# Altium project PCB.PrjPcb
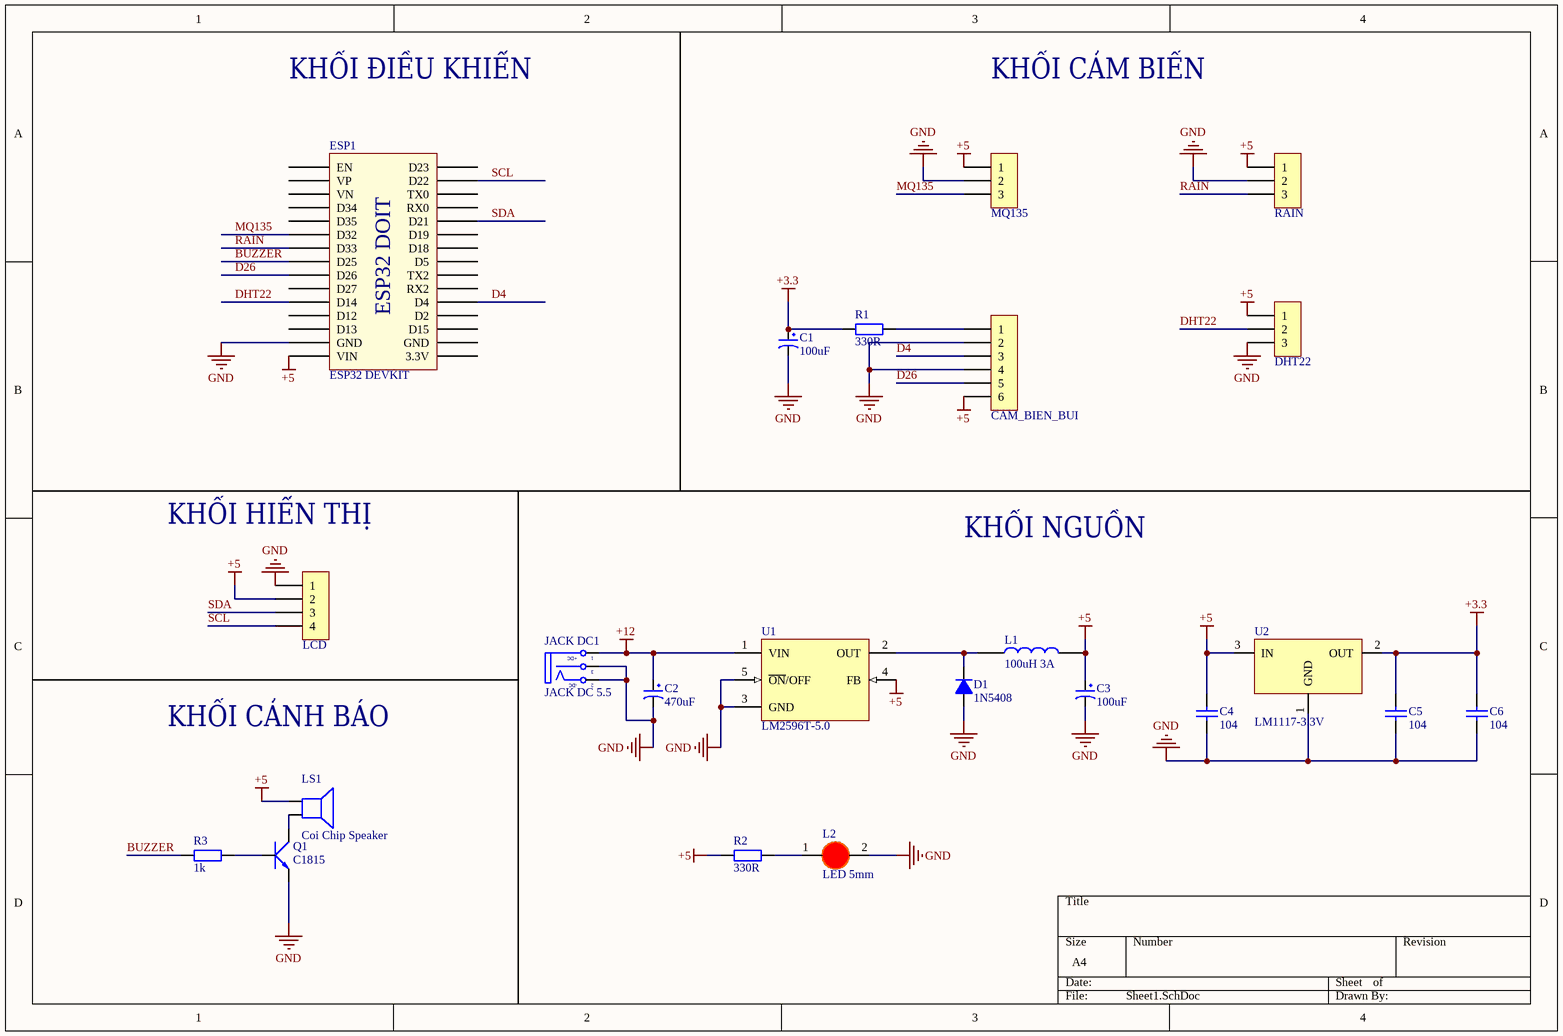
[diagram p0: Sheet1.SchDoc]
1 sheet, 23 parts. Net scope: global (net labels, ports and power ports of the same name join across sheets).
Board file: PCB1.PcbDoc

## Sheet Sheet1.SchDoc
size A4; SheetNumber: 1; SheetTotal: 1

### Parts
C1  100uF  [tu hoa 8mm]
C2  470uF  [tu hoa 8mm]
C3  100uF  [tu hoa 8mm]
C4  104  [tu gom]
C5  104  [tu gom]
C6  104  [tu gom]
D1  1N5408  [D5A]
ESP1  ESP32 DEVKIT  [ESP32 WROOM 32 KIT]
H1  MQ135  [XH2.54M-3]
H2  RAIN  [XH2.54M-3]
H3  DHT22  [XH2.54M-3]
H4  CAM_BIEN_BUI  [XH2.54M-6]
H5  LCD  [XH2.54M-4]
JACK_DC1  JACK DC 5.5  [JACK DC 5.5]
L1  100uH 3A  [CUON CAM 100uH3A]
L2  LED 5mm  [LED-5MM-RED]
LS1  Coi Chip Speaker  [Coi Chip Speacker]
Q1  C1815  [TO92]
R1  330R  [tro vach 1/4w]
R2  330R  [tro vach 1/4w]
R3  1k  [tro vach 1/4w]
U1  LM2596T-5.0  [LM2576t]
U2  LM1117-3.3V  [SOT223-4N]

### Nets
+3.3: C1.1 C5.1 C6.1 R1.1 U2.2(OUT)
+5: C3.1 C4.1 ESP1.15(VIN) H1.1 H2.1 H3.1 H4.6 H5.2 L1.2 LS1.1 R2.1 U1.4(FB) U2.3(IN)
+12: C2.1 JACK_DC1.1(T) U1.1(VIN)
GND: C1.2 C2.2 C3.2 C4.2 C5.2 C6.2 D1.1(A) ESP1.14(GND) H1.2 H2.2 H3.3 H4.2 H4.4 H5.1 JACK_DC1.2(TN) JACK_DC1.3(S) L2.2(K) Q1.1(E) U1.3(GND) U1.5(~{ON}/OFF) U2.1(GND)
BUZZER: ESP1.8(D25) R3.1
D4: ESP1.20(D4) H4.3
D26: ESP1.9(D26) H4.5
DHT22: ESP1.11(D14) H3.2
MQ135: ESP1.6(D32) H1.3
RAIN: ESP1.7(D33) H2.3
SCL: ESP1.29(D22) H5.4
SDA: ESP1.26(D21) H5.3
NetD1_2: D1.2(K) L1.1 U1.2(OUT)
NetH4_1: H4.1 R1.2
NetL2_1: L2.1(A) R2.2
NetLS1_2: LS1.2 Q1.2(C)
NetQ1_3: Q1.3(B) R3.2

Not connected (* = marked no-connect by the designer): ESP1 1(EN) 2(VP) 3(VN) 4(D34) 5(D35) 10(D27) 12(D12) 13(D13) 16(3.3V) 17(GND) 18(D15) 19(D2) 21(RX2) 22(TX2) 23(D5) 24(D18) 25(D19) 27(RX0) 28(TX0) 30(D23)

### Notes on the sheet
- KHỐI ĐIỀU KHIỂN
- KHỐI CẢM BIẾN
- KHỐI HIỂN THỊ
- KHỐI NGUỒN
- KHỐI CẢNH BÁO
- (in symbol ESP32 WROOM 32 KIT) ESP32 DOIT
- (in symbol JACK DC 5.5) +DC; -DC

### Library data of the parts
C1 C3 = Tu Hoa 100uF 50V 8x11: Cắm; Don_Vi: Con; So_Chan: 2; Ten_Linh_Kien: Tụ Hóa 100uF 50V 8x11MM; Ma_Hang: MH006872; Chung_Loai: Cắm; Kieu_Chan: *
C2 = Tu Hoa 470uF 25V 8x13: Cắm; Don_Vi: Con; So_Chan: 2; Ten_Linh_Kien: Tụ Hóa 470uF 25V; Ma_Hang: MH 470uF 25V; Chung_Loai: Cắm; Kieu_Chan: *
C4-C6 = Tu gom 104 50V: Cắm; So_Chan: 2; Ten_Linh_Kien: Tụ gốm 104 100nF 50V; Don_Vi: Con; Ma_Hang: MH004761; Chung_Loai: Cắm; Kieu_Chan: *
D1 = D5A: Diode 5A; Value: 1N5408
ESP1 = ESP32 WROOM 32 KIT
H1-H3 = Header 3P 2.54 Duc Thang: Cắm; Ten_Linh_Kien: Header 3P XH2.54-3P Đực Thẳng; Don_Vi: Con; Ma_Hang: MH001292; Chung_Loai: Cắm
H4 = Header 6P 2.54 Duc Thang: Cắm; Ten_Linh_Kien: Header 6P XH2.54-6P Đực Thẳng; Don_Vi: Con; Ma_Hang: MH001972; Chung_Loai: Cắm
H5 = Header 4P 2.54 Duc Thang: Cắm; Ten_Linh_Kien: Header 4P XH2.54-4P Đực Thẳng; Don_Vi: Con; Ma_Hang: MH001285; Chung_Loai: Cắm
JACK_DC1 = JACK DC 5.5: Value: Jac DC
L1 = CUON CAM 100uH DIP: Dán; Don_Vi: Con; Ma_Hang: MH002209; Ten_Linh_Kien: Cuộn Cảm 100uH 3A 8x10MM; Chung_Loai: Dán; Ghi Chu: *; Kieu Chan: *
L2 = LED 5mm Do: Cắm; Don_Vi: Con; Ma_Hang: MH008967; Ten_Linh_Kien: Led 5MM Phủ Đỏ (1000c); Ghi_Chu: *; Kieu_Chan: *; Chung_Loai: Cắm
LS1 = Coi Chip Speaker: Còi chip
Q1 = Trans C1815 DIP: NPN transistor; Value: C9014
R1 R2 = Tro Vach 1/4W 5% 330R: Cắm; Don_Vi: Con; So_Chan: 2; Ten_Linh_Kien: Trở Vạch 1/4W 5% 330R; Ma_Hang: MH007436; Chung_Loai: Cắm; Kieu_Chan: *
R3 = Tro Vach 1/4W 5% 1k: Cắm; Don_Vi: Con; So_Chan: 2; Ten_Linh_Kien: Trở Vạch 1/4w 5% 1k; Ma_Hang: MH007390; Chung_Loai: Cắm; Kieu_Chan: *
U1 = LM2576T-5.0: SIMPLE SWITCHER; 3A Step-Down Voltage Regulator; Manufacturer: National Semiconductor; PackageTopMarking: NSUZXYTT*LM2576T*-5.0 P+; PowerWise: N; FirstPublished: 4-Dec-2008; DatasheetVersion: Aug-2004; PackageVersion: revJ, Jan-1992; PackageReference: T05A; Publisher: Altium Limited; PackageDescription: TO-220, Molded, 5 Lead, Straight; CompType: Switcher; PartNumber: LM2576T-5.0; RoHS: O; PinCount: 5; DigiKeyPartNumber: LM2576T-5.0-ND; Code_JEDEC: TO-220-AB; ComponentLink1Description: LM2576 Datasheet; ComponentLink1URL: http://www.national.com/ds/LM/LM2576.pdf; ComponentLink2Description: LM2576 Web Page; ComponentLink2URL: http://www.national.com/pf/LM/LM2576.html; ComponentLink3Description: T05A Package Page; ComponentLink3URL: http://www.national.com/packaging/folders/t05a.html
U2 = LM1117: 800mA Low-Dropout Linear Regulator; Creator: Nguyen Ba Bien; Website: http://group3i.net